# EAGLE schematic board1 (EAGLE 6.6.0)

## Sheet 1 of 4
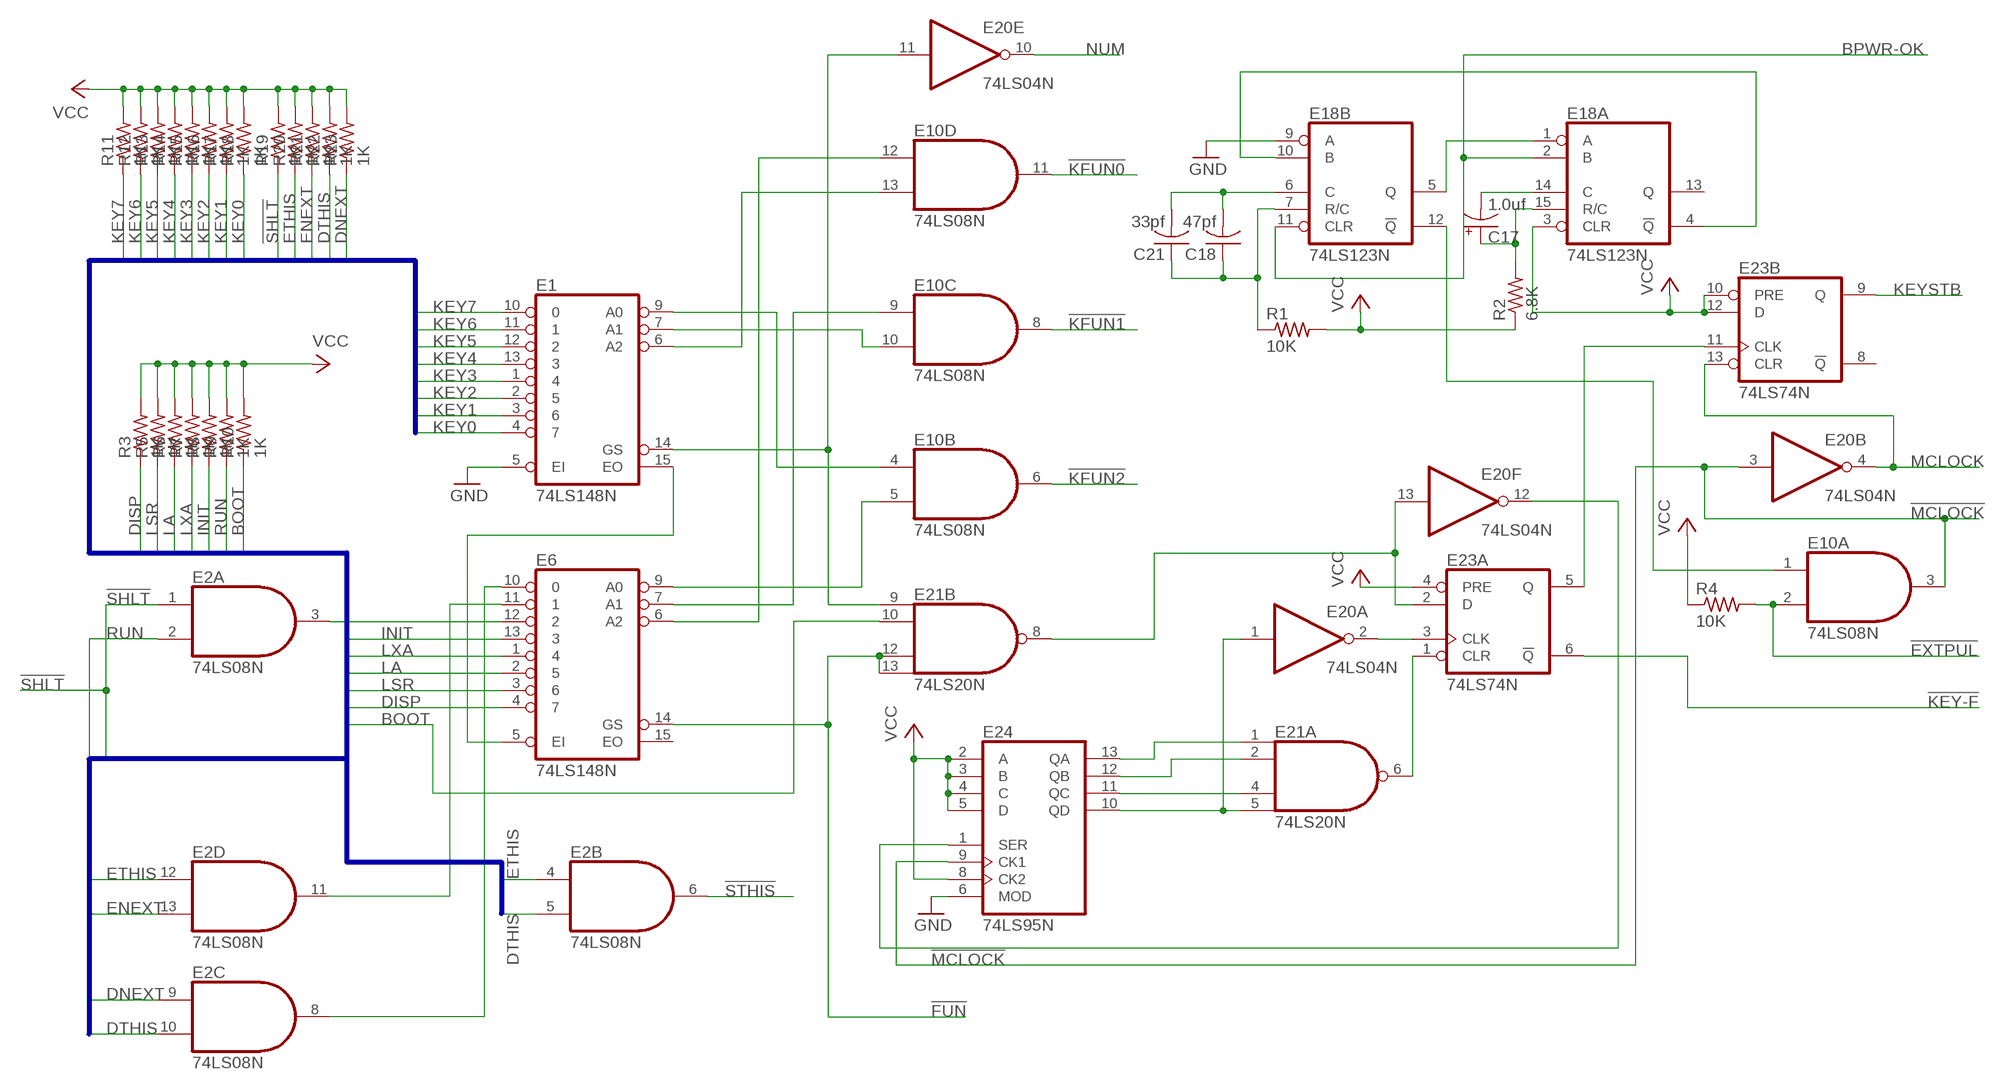
[diagram p0: schematic, sheet 1]

### Parts
C17  1.0uf  CPOL-USE15-5AXIAL  [E15-5]
C18  47pf  C-US050-025X075  [C050-025X075]
C21  33pf  C-US050-025X075  [C050-025X075]
E1  74LS148N  [DIL16]
E2  74LS08N  [DIL14]
E6  74LS148N  [DIL16]
E10  74LS08N  [DIL14]
E18  74LS123N  [DIL16]
E20  74LS04N  [DIL14]
E21  74LS20N  [DIL14]
E23  74LS74N  [DIL14]
E24  74LS95N  [DIL14]
R1  10K  R-US_0207/10  [0207/10]
R2  6.8K  R-US_0207/10  [0207/10]
R3  1K  R-US_0207/10  [0207/10]
R4  10K  R-US_0207/10  [0207/10]
R5  1K  R-US_0207/10  [0207/10]
R6  1K  R-US_0207/10  [0207/10]
R7  1K  R-US_0207/10  [0207/10]
R8  1K  R-US_0207/10  [0207/10]
R9  1K  R-US_0207/10  [0207/10]
R10  1K  R-US_0207/10  [0207/10]
R11  1K  R-US_0207/10  [0207/10]
R12  1K  R-US_0207/10  [0207/10]
R13  1K  R-US_0207/10  [0207/10]
R14  1K  R-US_0207/10  [0207/10]
R15  1K  R-US_0207/10  [0207/10]
R16  1K  R-US_0207/10  [0207/10]
R17  1K  R-US_0207/10  [0207/10]
R18  1K  R-US_0207/10  [0207/10]
R19  1K  R-US_0207/10  [0207/10]
R20  1K  R-US_0207/10  [0207/10]
R21  1K  R-US_0207/10  [0207/10]
R22  1K  R-US_0207/10  [0207/10]
R23  1K  R-US_0207/10  [0207/10]

### Nets
!EXTPUL: E10.2(A:I1) R4.2 ; also sheet 3
!FUN: E6.14(GS) E21.12(B:I2) E21.13(B:I3) ; also sheet 3
!KEY-F: E23.6(A:!Q) ; also sheet 3
!KFUN0: E10.11(D:O) ; also sheet 3
!KFUN1: E10.8(C:O) ; also sheet 3
!KFUN2: E10.6(B:O) ; also sheet 3
!MCLOCK: E10.3(A:O) E20.3(B:I) E24.9(CK1) ; also sheet 3
!SHLT: E2.1(A:I0) R19.1 ; also sheet 3,4
!STHIS: E2.6(B:O) ; also sheet 3
BOOT: E21.10(B:I1) R10.1 ; also sheet 4
BPWR-OK: E18.2(A:B) E18.11(B:CLR) ; also sheet 3
DISP: E6.4 R3.1 ; also sheet 4
DNEXT: E2.9(C:I0) R23.1 ; also sheet 4
DTHIS: E2.5(B:I1) E2.10(C:I1) R22.1 ; also sheet 4
ENEXT: E2.13(D:I1) R21.1 ; also sheet 4
ETHIS: E2.4(B:I0) E2.12(D:I0) R20.1 ; also sheet 4
GND [Supply]: E1.5(EI) E18.9(B:A) E24.6(MOD) ; also sheet 2,3,4
INIT: E6.13 R8.1 ; also sheet 4
KEY0: E1.4 R18.1 ; also sheet 4
KEY1: E1.3 R17.1 ; also sheet 4
KEY2: E1.2 R16.1 ; also sheet 4
KEY3: E1.1 R15.1 ; also sheet 4
KEY4: E1.13 R14.1 ; also sheet 4
KEY5: E1.12 R13.1 ; also sheet 4
KEY6: E1.11 R12.1 ; also sheet 4
KEY7: E1.10 R11.1 ; also sheet 4
KEYSTB: E23.9(B:Q) ; also sheet 3
LA: E6.2 R6.1 ; also sheet 4
LSR: E6.3 R5.1 ; also sheet 4
LXA: E6.1 R7.1 ; also sheet 4
MCLOCK: E20.4(B:O) E23.13(B:CLR) ; also sheet 2
N$1: E1.6(A2) E10.13(D:I1)
N$2: E1.7(A1) E10.10(C:I1)
N$3: E1.9(A0) E10.4(B:I0)
N$4: E1.14(GS) E20.11(E:I) E21.9(B:I0)
N$5: E6.6(A2) E10.12(D:I0)
N$6: E6.7(A1) E10.9(C:I0)
N$7: E6.9(A0) E10.5(B:I1)
N$8: E1.15(EO) E6.5(EI)
N$9: E21.1(A:I0) E24.13(QA)
N$10: E21.2(A:I1) E24.12(QB)
N$11: E21.4(A:I2) E24.11(QC)
N$12: E20.1(A:I) E21.5(A:I3) E24.10(QD)
N$13: E21.6(A:O) E23.1(A:CLR)
N$14: E20.2(A:O) E23.3(A:CLK)
N$15: E20.13(F:I) E21.8(B:O) E23.2(A:D)
N$16: E20.12(F:O) E24.1(SER)
N$17: E23.5(A:Q) E23.11(B:CLK)
N$18: E18.1(A:A) E18.5(B:Q)
N$19: C18.1 C21.1 E18.7(B:R/C) R1.1
N$20: C17.+ E18.15(A:R/C) R2.2
N$21: C18.2 C21.2 E18.6(B:C)
N$22: C17.- E18.14(A:C)
N$23: E2.3(A:O) E6.12
N$24: E18.4(A:!Q) E18.10(B:B)
N$25: E2.11(D:O) E6.11
N$26: E2.8(C:O) E6.10
N$27: E10.1(A:I0) E18.12(B:!Q)
NUM: E20.10(E:O) ; also sheet 3
RUN: E2.2(A:I1) R9.1 ; also sheet 4
VCC [Supply]: E18.3(A:CLR) E23.4(A:PRE) E23.10(B:PRE) E23.12(B:D) E24.2(A) E24.3(B) E24.4(C) E24.5(D) E24.8(CK2) R1.2 R2.1 R3.2 R4.1 R5.2 R6.2 R7.2 R8.2 R9.2 R10.2 R11.2 R12.2 R13.2 R14.2 R15.2 R16.2 R17.2 R18.2 R19.2 R20.2 R21.2 R22.2 R23.2 ; also sheet 2,3
Unconnected: E6.15(EO) E18.13(A:Q) E20.5(C:I) E20.6(C:O) E20.8(D:O) E20.9(D:I) E23.8(B:!Q)

### Buses
KEY[0..7],DISP,LSR,LA,LXA,INIT,RUN,BOOT,!SHLT,ETHIS,ENEXT,DTHIS,DNEXT

## Sheet 2 of 4
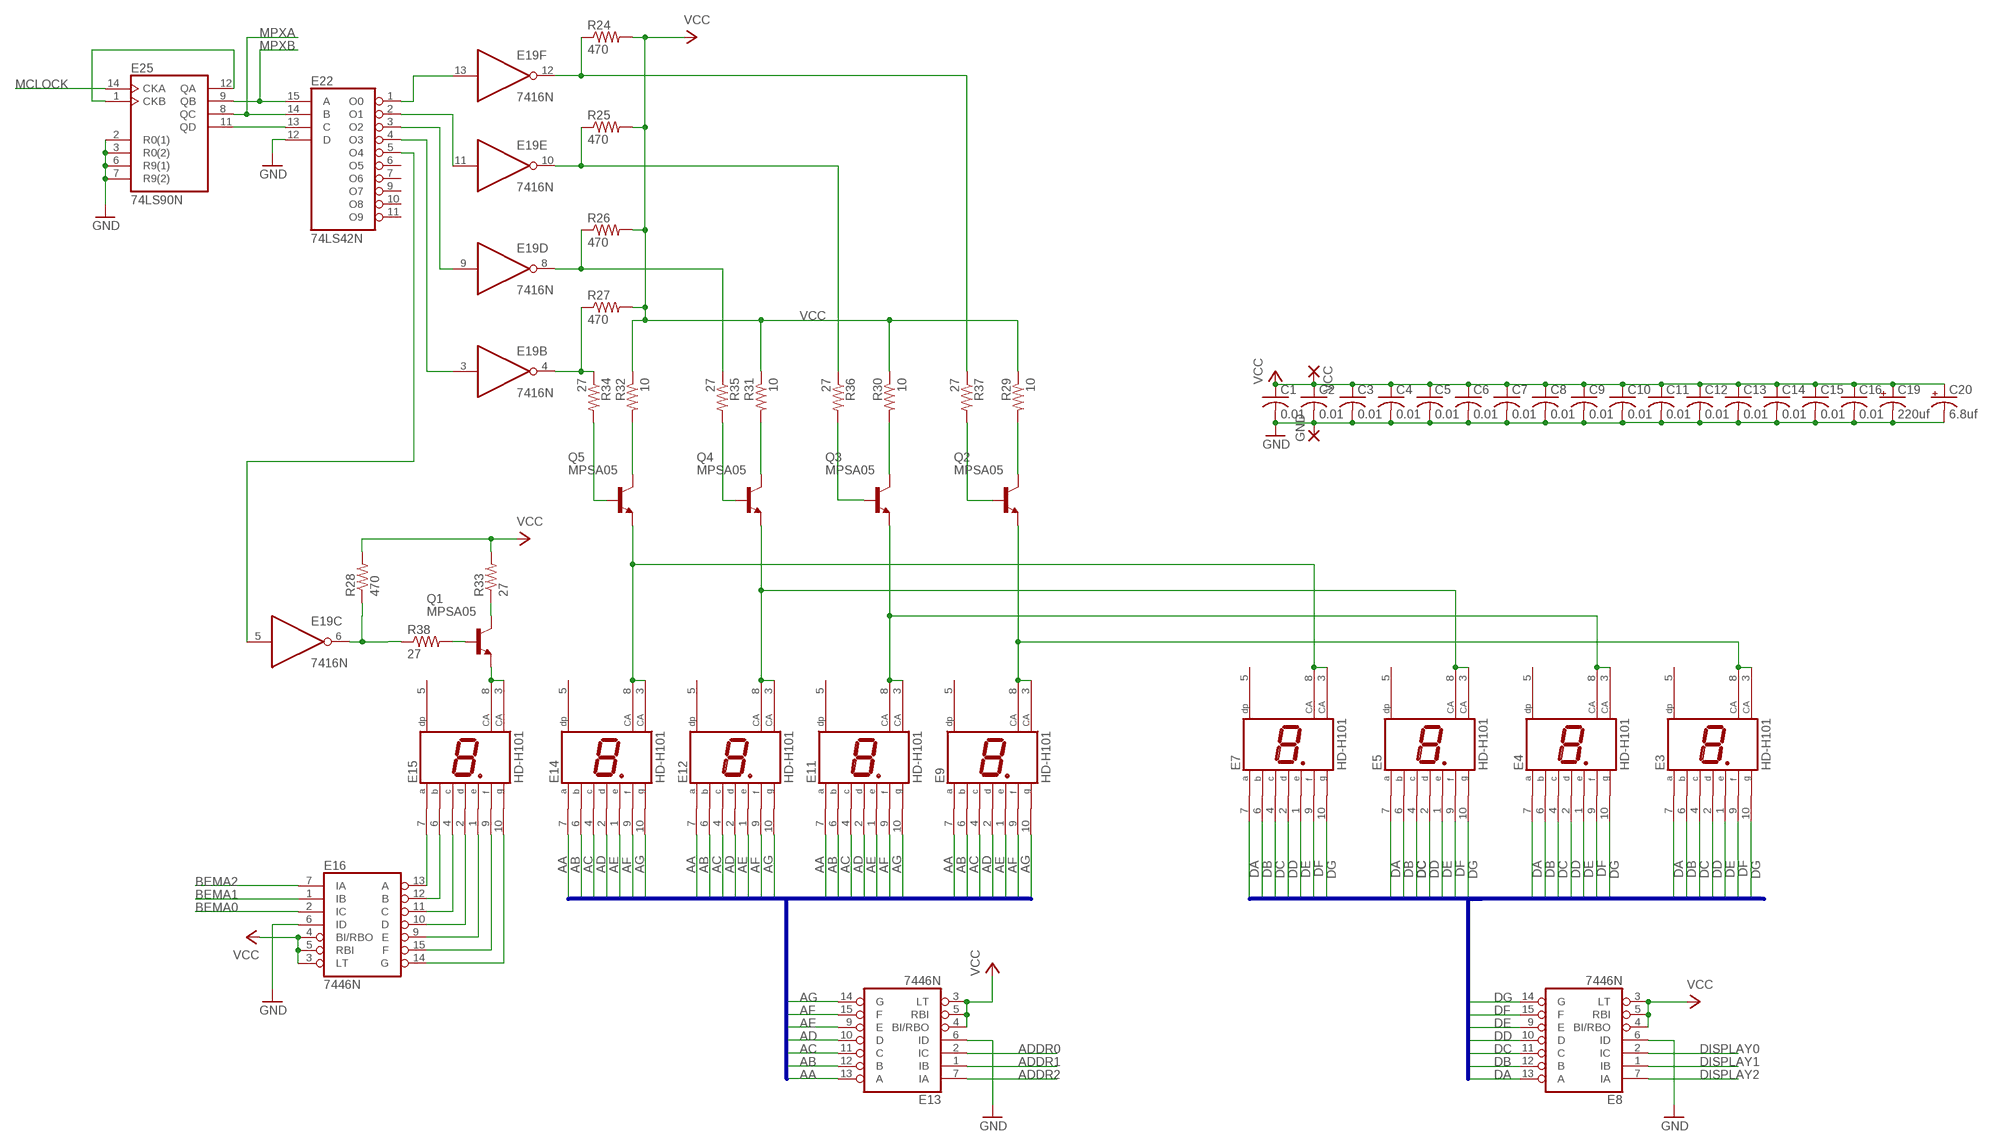
[diagram p1: schematic, sheet 2]

### Parts
C1  0.01  C-US050-025X075  [C050-025X075]
C2  0.01  C-US050-025X075  [C050-025X075]
C3  0.01  C-US050-025X075  [C050-025X075]
C4  0.01  C-US050-025X075  [C050-025X075]
C5  0.01  C-US050-025X075  [C050-025X075]
C6  0.01  C-US050-025X075  [C050-025X075]
C7  0.01  C-US050-025X075  [C050-025X075]
C8  0.01  C-US050-025X075  [C050-025X075]
C9  0.01  C-US050-025X075  [C050-025X075]
C10  0.01  C-US050-025X075  [C050-025X075]
C11  0.01  C-US050-025X075  [C050-025X075]
C12  0.01  C-US050-025X075  [C050-025X075]
C13  0.01  C-US050-025X075  [C050-025X075]
C14  0.01  C-US050-025X075  [C050-025X075]
C15  0.01  C-US050-025X075  [C050-025X075]
C16  0.01  C-US050-025X075  [C050-025X075]
C19  220uf  CPOL-USE22-6AXIAL  [E22-6]
C20  6.8uf  CPOL-USE22-6AXIAL  [E22-6]
E3  HD-H101  [HDSP-M]
E4  HD-H101  [HDSP-M]
E5  HD-H101  [HDSP-M]
E7  HD-H101  [HDSP-M]
E8  7446N  [DIL16]
E9  HD-H101  [HDSP-M]
E11  HD-H101  [HDSP-M]
E12  HD-H101  [HDSP-M]
E13  7446N  [DIL16]
E14  HD-H101  [HDSP-M]
E15  HD-H101  [HDSP-M]
E16  7446N  [DIL16]
E19  7416N  [DIL14]
E22  74LS42N  [DIL16]
E25  74LS90N  [DIL14]
GND  3,81/1,4  [3,81/1,4]
Q1  MPSA05  2N2222A  [TO18]
Q2  MPSA05  2N2222A  [TO18]
Q3  MPSA05  2N2222A  [TO18]
Q4  MPSA05  2N2222A  [TO18]
Q5  MPSA05  2N2222A  [TO18]
R24  470  R-US_0207/10  [0207/10]
R25  470  R-US_0207/10  [0207/10]
R26  470  R-US_0207/10  [0207/10]
R27  470  R-US_0207/10  [0207/10]
R28  470  R-US_0207/10  [0207/10]
R29  10  R-US_0207/10  [0207/10]
R30  10  R-US_0207/10  [0207/10]
R31  10  R-US_0207/10  [0207/10]
R32  10  R-US_0207/10  [0207/10]
R33  27  R-US_0207/10  [0207/10]
R34  27  R-US_0207/10  [0207/10]
R35  27  R-US_0207/10  [0207/10]
R36  27  R-US_0207/10  [0207/10]
R37  27  R-US_0207/10  [0207/10]
R38  27  R-US_0207/10  [0207/10]
VCC  3,81/1,4  [3,81/1,4]

### Nets
AA: E9.7(A) E11.7(A) E12.7(A) E13.13(A) E14.7(A)
AB: E9.6(B) E11.6(B) E12.6(B) E13.12(B) E14.6(B)
AC: E9.4(C) E11.4(C) E12.4(C) E13.11(C) E14.4(C)
AD: E9.2(D) E11.2(D) E12.2(D) E13.10(D) E14.2(D)
ADDR0: E13.2(IC) ; also sheet 3
ADDR1: E13.1(IB) ; also sheet 3
ADDR2: E13.7(IA) ; also sheet 3
AE: E9.1(E) E11.1(E) E12.1(E) E13.9(E) E14.1(E)
AF: E9.9(F) E11.9(F) E12.9(F) E13.15(F) E14.9(F)
AG: E9.10(G) E11.10(G) E12.10(G) E13.14(G) E14.10(G)
BEMA0: E16.2(IC) ; also sheet 3
BEMA1: E16.1(IB) ; also sheet 3
BEMA2: E16.7(IA) ; also sheet 3
DA: E3.7(A) E4.7(A) E5.7(A) E7.7(A) E8.13(A)
DB: E3.6(B) E4.6(B) E5.6(B) E7.6(B) E8.12(B)
DC: E3.4(C) E4.4(C) E5.4(C) E7.4(C) E8.11(C)
DD: E3.2(D) E4.2(D) E5.2(D) E7.2(D) E8.10(D)
DE: E3.1(E) E4.1(E) E5.1(E) E7.1(E) E8.9(E)
DF: E3.9(F) E4.9(F) E5.9(F) E7.9(F) E8.15(F)
DG: E3.10(G) E4.10(G) E5.10(G) E7.10(G) E8.14(G)
DISPLAY0: E8.2(IC) ; also sheet 3
DISPLAY1: E8.1(IB) ; also sheet 3
DISPLAY2: E8.7(IA) ; also sheet 3
GND [Supply]: C1.2 C2.2 C3.2 C4.2 C5.2 C6.2 C7.2 C8.2 C9.2 C10.2 C11.2 C12.2 C13.2 C14.2 C15.2 C16.2 C19.- C20.- E8.6(ID) E13.6(ID) E16.6(ID) E22.12(D) E25.2(R0(1)) E25.3(R0(2)) E25.6(R9(1)) E25.7(R9(2)) GND.1(P) ; also sheet 1,3,4
MCLOCK: E25.14(CKA) ; also sheet 1
MPXA: E22.14(B) E25.8(QC) ; also sheet 3
MPXB: E22.15(A) E25.9(QB) ; also sheet 3
N$28: E15.7(A) E16.13(A)
N$29: E15.6(B) E16.12(B)
N$30: E15.4(C) E16.11(C)
N$31: E15.2(D) E16.10(D)
N$32: E15.1(E) E16.9(E)
N$33: E15.9(F) E16.15(F)
N$34: E15.10(G) E16.14(G)
N$35: E19.12(F:O) R24.1 R37.1
N$36: E19.10(E:O) R25.1 R36.1
N$37: E22.13(C) E25.11(QD)
N$39: E25.1(CKB) E25.12(QA)
N$40: E19.8(D:O) R26.1 R35.1
N$41: E19.13(F:I) E22.1(O0)
N$42: E19.11(E:I) E22.2(O1)
N$43: E19.9(D:I) E22.3(O2)
N$44: E19.3(B:I) E22.4(O3)
N$45: E19.5(C:I) E22.5(O4)
N$46: E19.4(B:O) R27.1 R34.1
N$47: E15.3(CA) E15.8(CA) Q1.1(E)
N$48: Q2.3(C) R29.2
N$49: Q3.3(C) R30.2
N$50: Q4.3(C) R31.2
N$51: Q5.3(C) R32.2
N$52: Q1.3(C) R33.1
N$53: Q1.2(B) R38.2
N$54: E7.3(CA) E7.8(CA) E14.3(CA) E14.8(CA) Q5.1(E)
N$55: Q5.2(B) R34.2
N$56: Q4.2(B) R35.2
N$57: Q3.2(B) R36.2
N$58: Q2.2(B) R37.2
N$59: E19.6(C:O) R28.1 R38.1
N$60: E5.3(CA) E5.8(CA) E12.3(CA) E12.8(CA) Q4.1(E)
N$61: E4.3(CA) E4.8(CA) E11.3(CA) E11.8(CA) Q3.1(E)
N$62: E3.3(CA) E3.8(CA) E9.3(CA) E9.8(CA) Q2.1(E)
VCC [Supply]: C1.1 C2.1 C3.1 C4.1 C5.1 C6.1 C7.1 C8.1 C9.1 C10.1 C11.1 C12.1 C13.1 C14.1 C15.1 C16.1 C19.+ C20.+ E8.3(LT) E8.4(BI/RBO) E8.5(RBI) E13.3(LT) E13.4(BI/RBO) E13.5(RBI) E16.3(LT) E16.4(BI/RBO) E16.5(RBI) R24.2 R25.2 R26.2 R27.2 R28.2 R29.1 R30.1 R31.1 R32.1 R33.2 VCC.1(P) ; also sheet 1,3
Unconnected: E3.5(DP) E4.5(DP) E5.5(DP) E7.5(DP) E9.5(DP) E11.5(DP) E12.5(DP) E14.5(DP) E15.5(DP) E22.6(O5) E22.7(O6) E22.9(O7) E22.10(O8) E22.11(O9)

### Buses
ASEG:AA,AB,AC,AD,AE,AF,AG
DSEG:DA,DB,DC,DD,DE,DF,DG

## Sheet 3 of 4
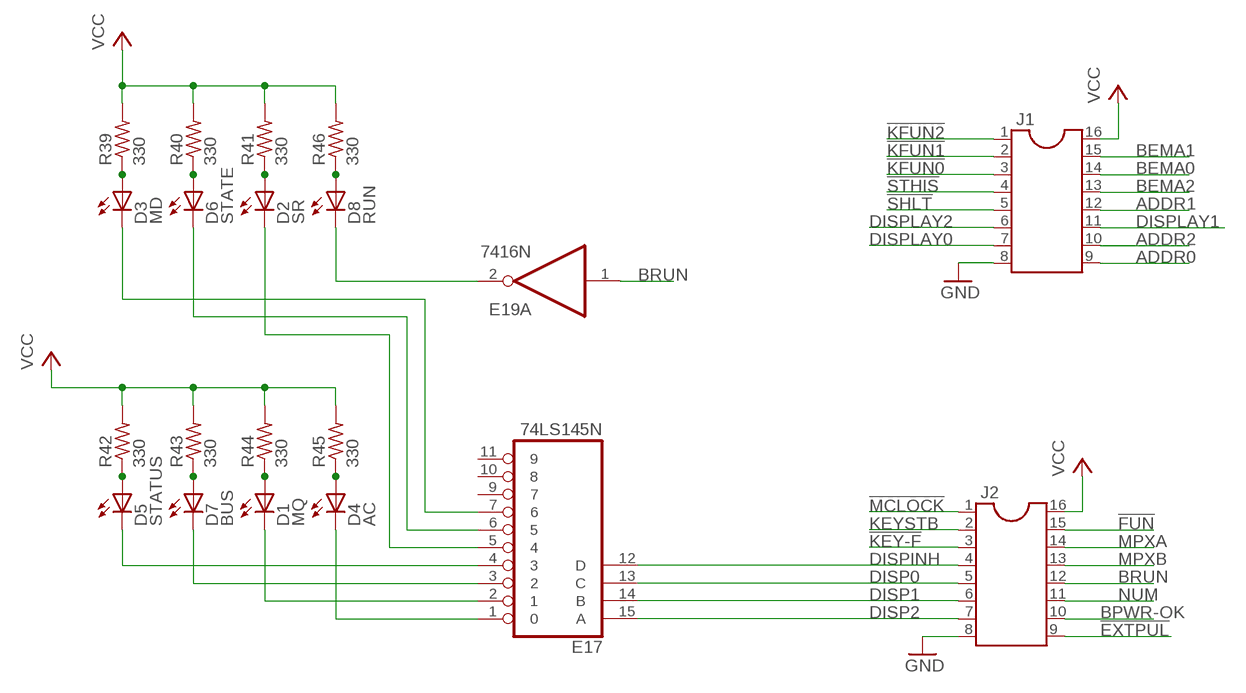
[diagram p2: schematic, sheet 3]

### Parts
D1  MQ  LED5MM  [LED5MM]
D2  SR  LED5MM  [LED5MM]
D3  MD  LED5MM  [LED5MM]
D4  AC  LED5MM  [LED5MM]
D5  STATUS  LED5MM  [LED5MM]
D6  STATE  LED5MM  [LED5MM]
D7  BUS  LED5MM  [LED5MM]
D8  RUN  LED5MM  [LED5MM]
E17  74LS145N  [DIL16]
J1  DIL16S  [SOCKET-16]
J2  DIL16S  [SOCKET-16]
R39  330  R-US_0207/10  [0207/10]
R40  330  R-US_0207/10  [0207/10]
R41  330  R-US_0207/10  [0207/10]
R42  330  R-US_0207/10  [0207/10]
R43  330  R-US_0207/10  [0207/10]
R44  330  R-US_0207/10  [0207/10]
R45  330  R-US_0207/10  [0207/10]
R46  330  R-US_0207/10  [0207/10]

### Nets
!EXTPUL: J2.9 ; also sheet 1
!FUN: J2.15 ; also sheet 1
!KEY-F: J2.3 ; also sheet 1
!KFUN0: J1.3 ; also sheet 1
!KFUN1: J1.2 ; also sheet 1
!KFUN2: J1.1 ; also sheet 1
!MCLOCK: J2.1 ; also sheet 1
!SHLT: J1.5 ; also sheet 1,4
!STHIS: J1.4 ; also sheet 1
ADDR0: J1.9 ; also sheet 2
ADDR1: J1.12 ; also sheet 2
ADDR2: J1.10 ; also sheet 2
BEMA0: J1.14 ; also sheet 2
BEMA1: J1.15 ; also sheet 2
BEMA2: J1.13 ; also sheet 2
BPWR-OK: J2.10 ; also sheet 1
BRUN: E19.1(A:I) J2.12
DISP0: E17.13(C) J2.5
DISP1: E17.14(B) J2.6
DISP2: E17.15(A) J2.7
DISPINH: E17.12(D) J2.4
DISPLAY0: J1.7 ; also sheet 2
DISPLAY1: J1.11 ; also sheet 2
DISPLAY2: J1.6 ; also sheet 2
GND [Supply]: J1.8 J2.8 ; also sheet 1,2,4
KEYSTB: J2.2 ; also sheet 1
MPXA: J2.14 ; also sheet 2
MPXB: J2.13 ; also sheet 2
N$38: D3.A R39.1
N$63: D6.A R40.1
N$64: D2.A R41.1
N$65: D5.A R42.1
N$66: D7.A R43.1
N$67: D1.A R44.1
N$68: D4.A R45.1
N$69: D8.A R46.1
N$70: D8.K(C) E19.2(A:O)
N$71: D4.K(C) E17.1
N$72: D1.K(C) E17.2
N$73: D7.K(C) E17.3
N$74: D5.K(C) E17.4
N$75: D2.K(C) E17.5
N$76: D6.K(C) E17.6
N$77: D3.K(C) E17.7
NUM: J2.11 ; also sheet 1
VCC [Supply]: J1.16 J2.16 R39.2 R40.2 R41.2 R42.2 R43.2 R44.2 R45.2 R46.2 ; also sheet 1,2
Unconnected: E17.9 E17.10 E17.11

## Sheet 4 of 4
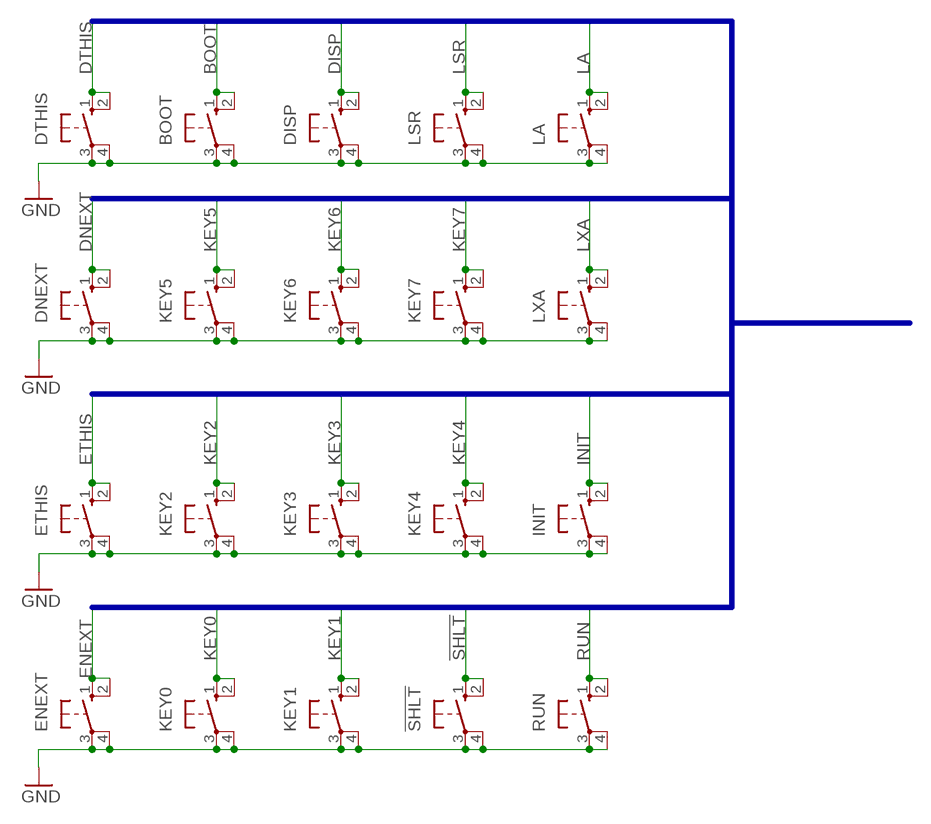
[diagram p3: schematic, sheet 4]

### Parts
!SHLT  40-XX  [B3F-40XX]
BOOT  40-XX  [B3F-40XX]
DISP  40-XX  [B3F-40XX]
DNEXT  40-XX  [B3F-40XX]
DTHIS  40-XX  [B3F-40XX]
ENEXT  40-XX  [B3F-40XX]
ETHIS  40-XX  [B3F-40XX]
INIT  40-XX  [B3F-40XX]
KEY0  40-XX  [B3F-40XX]
KEY1  40-XX  [B3F-40XX]
KEY2  40-XX  [B3F-40XX]
KEY3  40-XX  [B3F-40XX]
KEY4  40-XX  [B3F-40XX]
KEY5  40-XX  [B3F-40XX]
KEY6  40-XX  [B3F-40XX]
KEY7  40-XX  [B3F-40XX]
LA  40-XX  [B3F-40XX]
LSR  40-XX  [B3F-40XX]
LXA  40-XX  [B3F-40XX]
RUN  40-XX  [B3F-40XX]

### Nets
!SHLT: !SHLT.1(S) !SHLT.2(S1) ; also sheet 1,3
BOOT: BOOT.1(S) BOOT.2(S1) ; also sheet 1
DISP: DISP.1(S) DISP.2(S1) ; also sheet 1
DNEXT: DNEXT.1(S) DNEXT.2(S1) ; also sheet 1
DTHIS: DTHIS.1(S) DTHIS.2(S1) ; also sheet 1
ENEXT: ENEXT.1(S) ENEXT.2(S1) ; also sheet 1
ETHIS: ETHIS.1(S) ETHIS.2(S1) ; also sheet 1
GND [Supply]: !SHLT.3(P) !SHLT.4(P1) BOOT.3(P) BOOT.4(P1) DISP.3(P) DISP.4(P1) DNEXT.3(P) DNEXT.4(P1) DTHIS.3(P) DTHIS.4(P1) ENEXT.3(P) ENEXT.4(P1) ETHIS.3(P) ETHIS.4(P1) INIT.3(P) INIT.4(P1) KEY0.3(P) KEY0.4(P1) KEY1.3(P) KEY1.4(P1) KEY2.3(P) KEY2.4(P1) KEY3.3(P) KEY3.4(P1) KEY4.3(P) KEY4.4(P1) KEY5.3(P) KEY5.4(P1) KEY6.3(P) KEY6.4(P1) KEY7.3(P) KEY7.4(P1) LA.3(P) LA.4(P1) LSR.3(P) LSR.4(P1) LXA.3(P) LXA.4(P1) RUN.3(P) RUN.4(P1) ; also sheet 1,2,3
INIT: INIT.1(S) INIT.2(S1) ; also sheet 1
KEY0: KEY0.1(S) KEY0.2(S1) ; also sheet 1
KEY1: KEY1.1(S) KEY1.2(S1) ; also sheet 1
KEY2: KEY2.1(S) KEY2.2(S1) ; also sheet 1
KEY3: KEY3.1(S) KEY3.2(S1) ; also sheet 1
KEY4: KEY4.1(S) KEY4.2(S1) ; also sheet 1
KEY5: KEY5.1(S) KEY5.2(S1) ; also sheet 1
KEY6: KEY6.1(S) KEY6.2(S1) ; also sheet 1
KEY7: KEY7.1(S) KEY7.2(S1) ; also sheet 1
LA: LA.1(S) LA.2(S1) ; also sheet 1
LSR: LSR.1(S) LSR.2(S1) ; also sheet 1
LXA: LXA.1(S) LXA.2(S1) ; also sheet 1
RUN: RUN.1(S) RUN.2(S1) ; also sheet 1

### Buses
KEY[0..7],DISP,LSR,LA,LXA,INIT,RUN,BOOT,!SHLT,ETHIS,ENEXT,DTHIS,DNEXT

## Power pins joined to a net without a drawn wire
GND: E1.8(GND) E2.7(P:GND) E6.8(GND) E8.8(GND) E10.7(P:GND) E13.8(GND) E16.8(GND) E17.8(GND) E18.8(P:GND) E19.7(P:GND) E20.7(P:GND) E21.7(P:GND) E22.8(GND) E23.7(P:GND) E24.7(GND) E25.10(GND)
VCC: E1.16(VCC) E2.14(P:VCC) E6.16(VCC) E8.16(VCC) E10.14(P:VCC) E13.16(VCC) E16.16(VCC) E17.16(VCC) E18.16(P:VCC) E19.14(P:VCC) E20.14(P:VCC) E21.14(P:VCC) E22.16(VCC) E23.14(P:VCC) E24.14(VCC) E25.5(VCC)

## Library data of the parts
!SHLT BOOT DISP DNEXT DTHIS ENEXT ETHIS INIT KEY0 KEY1-KEY7 LA LSR LXA RUN = switch-omron:40-XX: OMRON SWITCH; MF: OMRON COMPONENTS USA; MPN: B3F-4000; OC_FARNELL: 176434; OC_NEWARK: 36K3105
C1-C16 C18 C21 = rcl:C-US: CAPACITOR, American symbol
C17 C19 C20 = rcl:CPOL-US: POLARIZED CAPACITOR, American symbol
D1-D8 = led:LED: LED OSRAM: - CHIPLED LG R971, LG N971, LY N971, LG Q971, LY Q971, LO R971, LY R971 LH N974, LH R974 LS Q976, LO Q976, LY Q976 LO Q996 - Hyper CHIPLED LW Q18S LB Q993, LB Q99A, LB R99A - SideLED LS A670, LO A670, LY A670, LG A670, LP A670 LB A673, LV A673, LT A673, LW A673 LH A674 LY A675 LS A676, LA A676, LO A676, LY A676, LW A676 LS A679, LY A679, LG A679 - Hyper Micro SIDELED® LS Y876, LA Y876, LO Y876, LY Y876 LT Y87S - SmartLED LW L88C, LW L88S LB L89C, LB L89S, LG L890 LS L89K, LO L89K, LY L89K LS L896, LA L896, LO L896, LY L896 - TOPLED LS T670, LO T670, LY T670, LG T670, LP T670 LSG T670, LSP T670, LSY T670, LOP T670, LYG T670 LG T671, LOG T671, LSG T671 LB T673, LV T673, LT T673, LW T673 LH T674 LS T676, LA T676, LO T676, LY T676, LB T676, LH T676, LSB T676, LW T676 LB T67C, LV T67C, LT T67C, LS T67K, LO T67K, LY T67K, LW E67C LS E67B, LA E67B, LO E67B, LY E67B, LB E67C, LV E67C, LT E67C LW T67C LS T679, LY T679, LG T679 LS T770, LO T770, LY T770, LG T770, LP T770 LB T773, LV T773, LT T773, LW T773 LH T774 LS E675, LA E675, LY E675, LS T675 LS T776, LA T776, LO T776, LY T776, LB T776 LHGB T686 LT T68C, LB T68C - Hyper Mini TOPLED® LB M676 - Mini TOPLED Santana® LG M470 LS M47K, LO M47K, LY M47K Source: http://www.osram.convergy.de LUXEON: - LUMILED® LXK2-PW12-R00, LXK2-PW12-S00, LXK2-PW14-U00, LXK2-PW14-V00 LXK2-PM12-R00, LXK2-PM12-S00, LXK2-PM14-U00 LXK2-PE12-Q00, LXK2-PE12-R00, LXK2-PE12-S00, LXK2-PE14-T00, LXK2-PE14-U00 LXK2-PB12-K00, LXK2-PB12-L00, LXK2-PB12-M00, LXK2-PB14-N00, LXK2-PB14-P00, LXK2-PB14-Q00 LXK2-PR12-L00, LXK2-PR12-M00, LXK2-PR14-Q00, LXK2-PR14-R00 LXK2-PD12-Q00, LXK2-PD12-R00, LXK2-PD12-S00 LXK2-PH12-R00, LXK2-PH12-S00 LXK2-PL12-P00, LXK2-PL12-Q00, LXK2-PL12-R00 Source: www.luxeon.com KINGBRIGHT: KA-3528ASYC Source: www.kingbright.com
E1 E6 = 74xx-us:74*148: 10-line to 4-line and 8-line to 3-line PRIORITY ENCODER
E2 E10 = 74xx-us:74*08: Quad 2-input AND gate
E3-E5 E7 E9 E11 E12 E14 E15 = display-hp:HD-H101: LED DISPLAY 1-character 7 segment, decimal point right; OC_FARNELL: unknown; OC_NEWARK: unknown
E8 E13 E16 = 74xx-us:74*46: BCD to seven segment DECODER/DRIVER, open collector
E17 = 74xx-us:74*145: BCD to decimal DECODER/DRIVER
E18 = 74xx-us:74*123: Retriggerable monostable MULTIVIBRATOR
E19 = 74xx-us:74*16: Hex INVERTER, open collector, high-voltage
E20 = 74xx-us:74*04: Hex INVERTER
E21 = 74xx-us:74*20: Dual 4-input NAND gate
E22 = 74xx-us:74*42: 4-line to 10-line DECODER (1-of-10)
E23 = 74xx-us:74*74: Dual D type positive edge triggered FLIP FLOP, preset and clear
E24 = 74xx-us:74*95: 4-bit parallel access SHIFT REGISTER
E25 = 74xx-us:74*90: Decade, divide by twelve and binary COUNTER
GND VCC = wirepad:3,81/1,4: THROUGH-HOLE PAD
J1 J2 = ic-package:DIL16: Dual In Line / Socket
Q1-Q5 = transistor-npn:2N2222*: NPN Transistor
R1-R46 = rcl:R-US_: RESISTOR, American symbol

## Net classes
1 Supply: width 0.635 mm